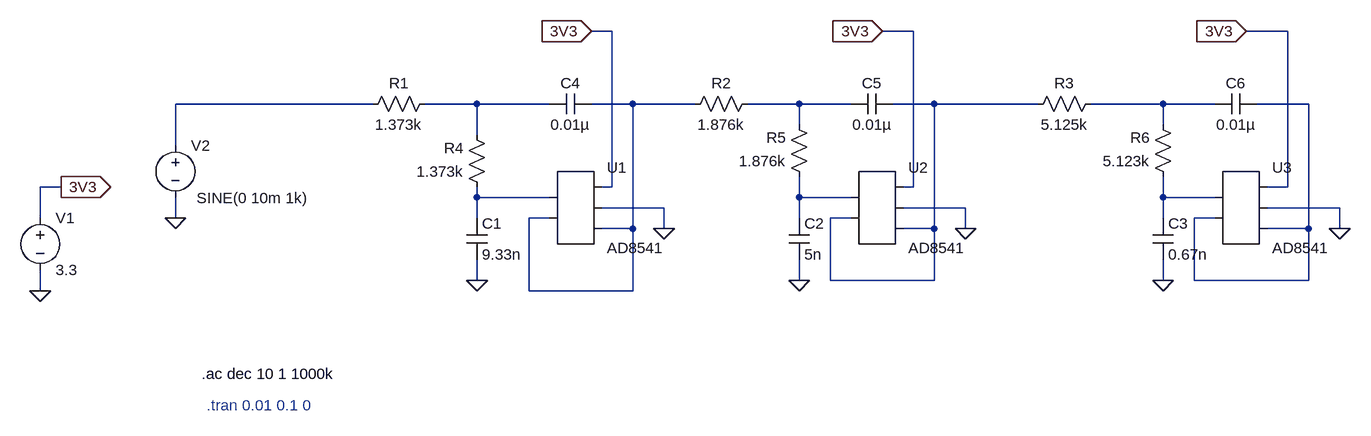
[diagram p0: schematic ACE_mic_antialias.asc]
ACE_mic_antialias.asc, the LTspice schematic file:
Version 4
SHEET 1 1600 680
WIRE 288 80 256 80
WIRE 752 80 704 80
WIRE 1328 80 1264 80
WIRE -80 192 -384 192
WIRE 80 192 0 192
WIRE 192 192 80 192
WIRE 320 192 256 192
WIRE 416 192 320 192
WIRE 576 192 496 192
WIRE 656 192 576 192
WIRE 784 192 720 192
WIRE 944 192 784 192
WIRE 1136 192 1024 192
WIRE 1216 192 1136 192
WIRE 1360 192 1280 192
WIRE 576 224 576 192
WIRE 1136 224 1136 192
WIRE 80 240 80 192
WIRE -384 256 -384 192
WIRE -560 320 -592 320
WIRE 288 320 288 80
WIRE 288 320 272 320
WIRE 752 320 752 80
WIRE 752 320 736 320
WIRE 1328 320 1328 80
WIRE 1328 320 1296 320
WIRE 80 336 80 320
WIRE 192 336 80 336
WIRE 576 336 576 304
WIRE 656 336 576 336
WIRE 1136 336 1136 304
WIRE 1216 336 1136 336
WIRE 368 352 272 352
WIRE 832 352 736 352
WIRE 1408 352 1296 352
WIRE -592 368 -592 320
WIRE -384 368 -384 336
WIRE 80 368 80 336
WIRE 192 368 160 368
WIRE 576 368 576 336
WIRE 656 368 624 368
WIRE 1136 368 1136 336
WIRE 1216 368 1184 368
WIRE 320 384 320 192
WIRE 320 384 272 384
WIRE 368 384 368 352
WIRE 784 384 784 192
WIRE 784 384 736 384
WIRE 832 384 832 352
WIRE 1360 384 1360 192
WIRE 1360 384 1296 384
WIRE 1408 384 1408 352
WIRE 80 464 80 432
WIRE 576 464 576 432
WIRE 624 464 624 368
WIRE 784 464 784 384
WIRE 784 464 624 464
WIRE 1136 464 1136 432
WIRE 1184 464 1184 368
WIRE 1360 464 1360 384
WIRE 1360 464 1184 464
WIRE -592 480 -592 448
WIRE 160 480 160 368
WIRE 320 480 320 384
WIRE 320 480 160 480
FLAG 80 464 0
FLAG 576 464 0
FLAG 1136 464 0
FLAG 368 384 0
FLAG 832 384 0
FLAG 1408 384 0
FLAG -384 368 0
FLAG -592 480 0
FLAG -560 320 3V3
IOPIN -560 320 Out
FLAG 256 80 3V3
IOPIN 256 80 In
FLAG 704 80 3V3
IOPIN 704 80 In
FLAG 1264 80 3V3
IOPIN 1264 80 In
SYMBOL AutoGenerated/AD8541 224 352 R0
SYMATTR InstName U1
SYMBOL AutoGenerated/AD8541 688 352 R0
SYMATTR InstName U2
SYMBOL AutoGenerated/AD8541 1248 352 R0
SYMATTR InstName U3
SYMBOL res 16 176 R90
WINDOW 0 0 56 VBottom 2
WINDOW 3 32 56 VTop 2
SYMATTR InstName R1
SYMATTR Value 1.373k
SYMBOL res 512 176 R90
WINDOW 0 0 56 VBottom 2
WINDOW 3 32 56 VTop 2
SYMATTR InstName R2
SYMATTR Value 1.876k
SYMBOL res 1040 176 R90
WINDOW 0 0 56 VBottom 2
WINDOW 3 32 56 VTop 2
SYMATTR InstName R3
SYMATTR Value 5.125k
SYMBOL res 96 336 R180
WINDOW 0 36 76 Left 2
WINDOW 3 36 40 Left 2
SYMATTR InstName R4
SYMATTR Value 1.373k
SYMBOL res 592 320 R180
WINDOW 0 36 76 Left 2
WINDOW 3 36 40 Left 2
SYMATTR InstName R5
SYMATTR Value 1.876k
SYMBOL res 1152 320 R180
WINDOW 0 36 76 Left 2
WINDOW 3 36 40 Left 2
SYMATTR InstName R6
SYMATTR Value 5.123k
SYMBOL cap 64 368 R0
SYMATTR InstName C1
SYMATTR Value 9.33n
SYMBOL cap 560 368 R0
SYMATTR InstName C2
SYMATTR Value 5n
SYMBOL cap 1120 368 R0
SYMATTR InstName C3
SYMATTR Value 0.67n
SYMBOL cap 256 176 R90
WINDOW 0 0 32 VBottom 2
WINDOW 3 32 32 VTop 2
SYMATTR InstName C4
SYMATTR Value 0.01µ
SYMBOL cap 720 176 R90
WINDOW 0 0 32 VBottom 2
WINDOW 3 32 32 VTop 2
SYMATTR InstName C5
SYMATTR Value 0.01µ
SYMBOL cap 1280 176 R90
WINDOW 0 0 32 VBottom 2
WINDOW 3 32 32 VTop 2
SYMATTR InstName C6
SYMATTR Value 0.01µ
SYMBOL voltage -592 352 R0
SYMATTR InstName V1
SYMATTR Value 3.3
SYMBOL voltage -384 240 R0
WINDOW 3 33 97 Left 2
SYMATTR Value SINE(0 10m 1k)
SYMATTR InstName V2
SYMATTR Value2 AC 1
TEXT -344 608 Left 2 !.ac dec 10 1 1000k
TEXT -336 656 Left 2 ;.tran 0.01 0.1 0

The netlist it stands for:
* ACE_mic_antialias.asc
* U1: AD8541 (symbol AutoGenerated/AD8541 not available, pins judged from their places): pin1=N008 pin2=N003 pin3=3V3 pin4=0 pin5=N003
* U2: AD8541 (symbol AutoGenerated/AD8541 not available, pins judged from their places): pin1=N009 pin2=N005 pin3=3V3 pin4=0 pin5=N005
* U3: AD8541 (symbol AutoGenerated/AD8541 not available, pins judged from their places): pin1=N010 pin2=N007 pin3=3V3 pin4=0 pin5=N007
R1 N002 N001 1.373k
R2 N004 N003 1.876k
R3 N006 N005 5.125k
R4 N008 N002 1.373k
R5 N009 N004 1.876k
R6 N010 N006 5.123k
C1 N008 0 9.33n
C2 N009 0 5n
C3 N010 0 0.67n
C4 N003 N002 0.01µ
C5 N005 N004 0.01µ
C6 N007 N006 0.01µ
V1 3V3 0 3.3
V2 N001 0 SINE(0 10m 1k) AC 1
.ac dec 10 1 1000k
* .tran 0.01 0.1 0
.backanno
.end